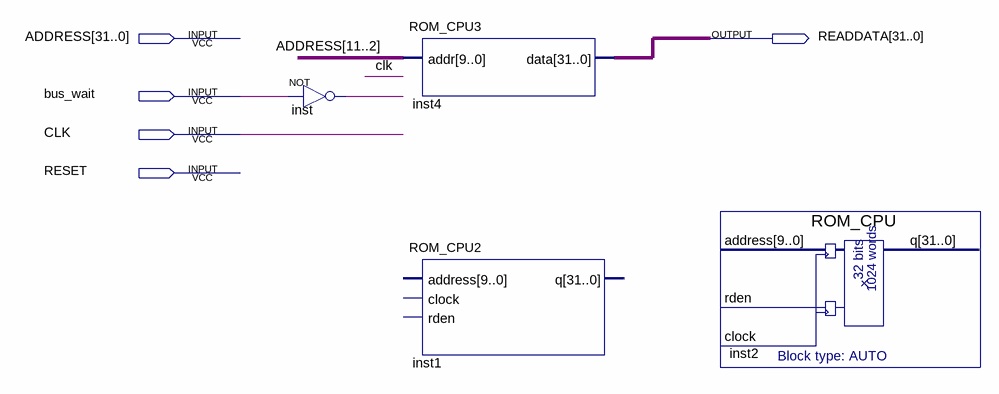
[diagram p0: schematic sheet]
// Quartus schematic InstrctionMemory2.bdf as structural Verilog: 4 symbols, 5 pins
module InstrctionMemory2 (
  input  [31:0] ADDRESS,
  input  bus_wait,
  input  CLK,
  input  RESET,
  output [31:0] READDATA
);

  wire inst_out;

  not inst (inst_out, bus_wait);
  ROM_CPU3 inst4 (.addr(ADDRESS[11:2]), .data(READDATA));
  ROM_CPU2 inst1 ();  // open: address, clock, rden, q
  ROM_CPU inst2 ();  // open: address, rden, clock, q
endmodule
